# Altium project Wilamp_DCU.PrjPCB (part 2 of 2)

## Sheet pic_blk.SchDoc
size A4; Engineer: JBayalas; DocumentNumber: 11; Revision: V1.1; SheetNumber: 11; SheetTotal: 13
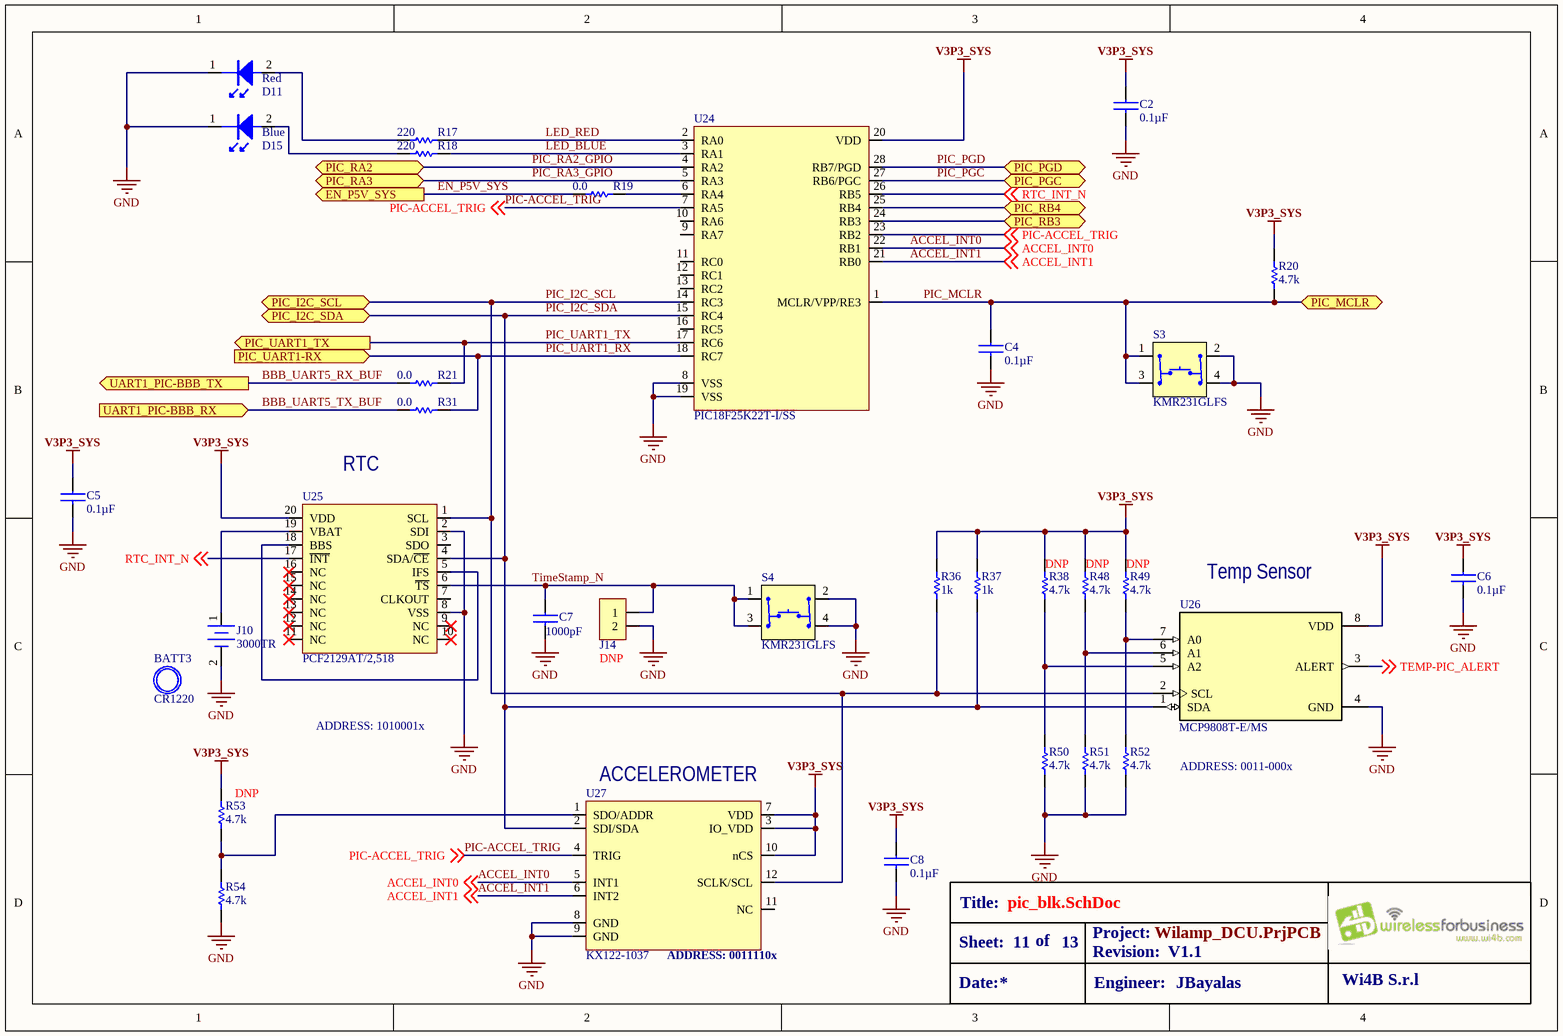
[diagram p11: pic_blk.SchDoc]

### Parts
BATT3  CR1220
C2  value 0.1µF  [C0402]  (hidden comment: *)
C4  value 0.1µF  [C0402]  (hidden comment: *)
C5  value 0.1µF  [C0402]  (hidden comment: *)
C6  value 0.1µF  [C0402]  (hidden comment: *)
C7  value 1000pF  [C0402]  (hidden comment: *)
C8  value 0.1µF  [C0402]  (hidden comment: *)
D11  value Red  [LED0402(RED)]  (hidden comment: *)
D15  value Blue  [LED0402(BLUE)]  (hidden comment: *)
J10  3000TR  [3000TR]
J14  LOAD: DNP  [2pin 5mm Pitch]  (hidden comment: *)
R17  value 220  [R0402]  (hidden comment: *)
R18  value 220  [R0402]  (hidden comment: *)
R19  value 0.0  [R0402]  (hidden comment: *)
R20  value 4.7k  [R0603]  (hidden comment: *)
R21  value 0.0  [R0402]  (hidden comment: *)
R31  value 0.0  [R0402]  (hidden comment: *)
R36  value 1k  [R0402]  (hidden comment: *)
R37  value 1k  [R0402]  (hidden comment: *)
R38  value 4.7k  LOAD: DNP  [R0402]  (hidden comment: *)
R48  value 4.7k  LOAD: DNP  [R0402]  (hidden comment: *)
R49  value 4.7k  LOAD: DNP  [R0402]  (hidden comment: *)
R50  value 4.7k  [R0402]  (hidden comment: *)
R51  value 4.7k  [R0402]  (hidden comment: *)
R52  value 4.7k  [R0402]  (hidden comment: *)
R53  value 4.7k  LOAD: DNP  [R0402]  (hidden comment: *)
R54  value 4.7k  [R0402]  (hidden comment: *)
S3  *  [KMR231G ULC LFS]  (value not drawn)
S4  *  [KMR231G ULC LFS]  (value not drawn)
U24  value PIC18F25K22T-I/SS  [SSOP-28 (PIC)]  (hidden comment: *)
U25  value PCF2129AT/2,518  [SOIC-20]  (hidden comment: *)
U26  MCP9808T-E/MS  [SOP65P490X110-8N]
U27  *  [KX122-1037]  (value not drawn)

### Ports
EN_P5V_SYS (out), PIC_I2C_SCL (bidir), PIC_I2C_SDA (bidir), PIC_MCLR (bidir), PIC_PGC (bidir), PIC_PGD (bidir), PIC_RA2 (bidir), PIC_RA3 (bidir), PIC_RB3 (bidir), PIC_RB4 (bidir), PIC_UART1-RX (in), PIC_UART1_TX (out), UART1_PIC-BBB_RX (in), UART1_PIC-BBB_TX (out)

### Nets
GND: C2.2 C4.2 C5.2 C6.2 C7.2 C8.2 D11.1 D15.1 J10.2(-) J14.2 R50.1 R51.1 R52.1 R54.1 S3.2 S3.4 S4.2 S4.4 U24.8(VSS) U24.19(VSS) U25.2(SDI) U25.8(VSS) U26.4(GND) U27.8(GND) U27.9(GND)
V3P3_SYS: C2.1 C5.1 C6.1 C8.1 R20.2 R36.2 R37.2 R38.2 R48.2 R49.2 R53.2 U24.20(VDD) U25.20(VDD) U26.8(VDD) U27.3(IO_VDD) U27.7(VDD) U27.10(nCS)
ACCEL_INT0: U24.22(RB1) U27.5(INT1) ; off-sheet ACCEL_INT0
ACCEL_INT1: U24.21(RB0) U27.6(INT2) ; off-sheet ACCEL_INT1
BBB_UART5_RX_BUF: R21.2 ; port UART1_PIC-BBB_TX
BBB_UART5_TX_BUF: R31.2 ; port UART1_PIC-BBB_RX
EN_P5V_SYS: R19.2 ; port EN_P5V_SYS
LED_BLUE: R18.2 U24.3(RA1)
LED_RED: R17.2 U24.2(RA0)
PIC-ACCEL_TRIG: U24.7(RA5) U24.23(RB2) U27.4(TRIG) ; off-sheet PIC-ACCEL_TRIG
PIC_GPIO_C: U24.25(RB4) ; port PIC_RB4
PIC_GPIO_D: U24.24(RB3) ; port PIC_RB3
PIC_I2C_SCL: R36.1 U24.14(RC3) U25.1(SCL) U26.2(SCL) U27.12(SCLK/SCL) ; port PIC_I2C_SCL
PIC_I2C_SDA: R37.1 U24.15(RC4) U25.4(SDA/~{CE}) U26.1(SDA) U27.2(SDI/SDA) ; port PIC_I2C_SDA
PIC_MCLR: C4.1 R20.1 S3.1 S3.3 U24.1(MCLR/VPP/RE3) ; port PIC_MCLR
PIC_PGC: U24.27(RB6/PGC) ; port PIC_PGC  [project net PIC_ICSP_CLK]
PIC_PGD: U24.28(RB7/PGD) ; port PIC_PGD  [project net PIC_ICSP_DAT]
PIC_RA2_GPIO: U24.4(RA2) ; port PIC_RA2  [project net PIC_GPIO_A]
PIC_RA3_GPIO: U24.5(RA3) ; port PIC_RA3  [project net PIC_GPIO_B]
PIC_UART1_RX: R31.1 U24.18(RC7) ; port PIC_UART1-RX
PIC_UART1_TX: R21.1 U24.17(RC6) ; port PIC_UART1_TX
RTC_INT_N: U24.26(RB5) U25.17(~{INT}) ; off-sheet RTC_INT_N
TEMP-PIC_ALERT: U26.3(ALERT) ; off-sheet TEMP-PIC_ALERT
TimeStamp_N: C7.1 J14.1 S4.1 S4.3 U25.6(~{TS})
NetD11_2: D11.2 R17.1
NetD15_2: D15.2 R18.1
NetJ10_1: J10.1(+) U25.19(VBAT)
NetR19_1: R19.1 U24.6(RA4)
NetR38_1: R38.1 R50.2 U26.5(A2)
NetR48_1: R48.1 R51.2 U26.6(A1)
NetR49_1: R49.1 R52.2 U26.7(A0)
NetR53_1: R53.1 R54.2 U27.1(SDO/ADDR)
NetU25_5: U25.5(IFS) U25.18(BBS)

Not connected (* = marked no-connect by the designer): U24 9(RA7) 10(RA6) 11(RC0) 12(RC1) 13(RC2) 16(RC5); U25 3(SDO) 7(CLKOUT) 9(NC)* 10(NC)* 11(NC)* 12(NC)* 13(NC)* 14(NC)* 15(NC)* 16(NC)*; U27 11(NC)

### Notes on the sheet
- RTC
- (near U26) Temp Sensor
- ADDRESS: 1010001x
- (near U27) ACCELEROMETER
- ADDRESS: 0011-000x
- (near U27) ADDRESS: 0011110x
- Title:
- Sheet:
- Date:
- of
- Project:
- Revision:
- Engineer:
- Wi4B S.r.l

### Library data of the parts
BATT3 = CR1220: Coin Cell Battery 35mAh 12.5mm; MFT: FDK; RATING: 3V, 35mAh; FUNCTION: PIC; TYPE: SMD; LOAD: *; VALUE: CR1220; MPN: CR1220
C2 C4-C6 C8 = CL05B104KO3LNNC: CAP CER 0.1UF 16V X7R 0402; MFT: Samsung Electro-Mechanics America, Inc.; RATING: ±10%, 16V; TYPE: Surface Mount, MLCC; FUNCTION: PIC; MPN: CL05B104KO3LNNC
C7 = GRM155R71H102KA01D: CAP CER 1000PF 50V X7R 0402; MFT: Murata Electronics North America; TYPE: SMD; FUNCTION: PIC; MPN: GRM155R71H102KA01D; LOAD: *; RATING: 50V
D11 = LNJ247W82RA: LED RED 0402 SMD; MFT: Panasonic Electronic Components; TYPE: Surface Mount; FUNCTION: PIC; MPN: LNJ247W82RA
D15 = VLMB1500-GS08: LED BLUE 0402 SMD; MFT: Vishay Semiconductor Opto Division; FUNCTION: PIC; MPN: VLMB1500-GS08; TYPE: SMD; RATING: *; LOAD: *
J10 = 3000TR: Coin Cell Battery Holders SM COIN CELL B/H; MFT: Keystone Electronics; FUNCTION: PIC; MPN: 3000TR; TYPE: SMD; RATING: *; LOAD: *; VALUE: 3000TR
J14 = 2PIN Signal 5mm Pitch: FUNCTION: PIC
R17 R18 = RC0402JR-07220RL: RES SMD 220 OHM 5% 1/16W 0402; MFT: Yageo; FUNCTION: PIC; MPN: RC0402JR-07220RL; RATING: *; TYPE: SMD; LOAD: *
R19 R21 R31 = CRCW04020000Z0ED: RES SMD 0.0OHM JUMPER 1/16W 0402; MFT: Vishay Dale; RATING: 63mW; FUNCTION: PIC; MPN: CRCW04020000Z0ED; TYPE: Surface Mount
R20 = ERA-3AEB472V: RES SMD 4.7K OHM 0.1% 1/10W 0603; MFT: Panasonic; FUNCTION: PIC; MPN: ERA-3AEB472V; LOAD: *; RATING: 1/10W; TYPE: SMD
R36 R37 = MCS04020C1001FE000: RES SMD 1K OHM 1% 1/10W 0402; MFT: Vishay Beyschlag; FUNCTION: PIC; MPN: MCS04020C1001FE000; TYPE: SMD; RATING: 1/10W; LOAD: *
R38 R48-R54 = RC0402JR-074K7L: RES SMD 4.7K OHM 5% 1/16W 0402; MFT: Yageo; FUNCTION: PIC; MPN: RC0402JR-074K7L; RATING: ±5%; TYPE: Surface Mount
S3 S4 = KMR231GLFS: SWITCH TACTILE SPST-NO 0.05A 32V; MFT: C&K Components; FUNCTION: PIC; VALUE: KMR231GLFS; TYPE: SMD; MPN: KMR231GLFS
U24 = PIC18F25K22T-I/SS: MCU 8BIT 32KB FLASH 28SSOP; MFT: Microchip; FUNCTION: PIC; MPN: PIC18F25K22T-I/SS; TYPE: SMD; RATING: *; LOAD: *
U25 = PCF2129AT/2,518: IC RTC /CALENDAR TCXO QTZ 20SOIC; MFT: NXP Semiconductors; FUNCTION: PIC; MPN: PCF2129AT/2,518; LOAD: *; TYPE: SMD; RATING: *
U26 = MCP9808T-E/MS: MCP9808 Series 3.6 V Memory Module Digital Temperature Sensor SMT - MSOP-8; MFT: Microchip; FUNCTION: PIC; MPN: MCP9808T-E/MS; TYPE: SMD; RATING: *; LOAD: *; VALUE: MCP9808T-E/MS
U27 = KX122-1037: ACCELEROMETER 2-8G I2C/SPI 12LGA; MFT: Kionix Inc.; FUNCTION: PIC; LOAD: *; RATING: *; TYPE: SMD; VALUE: KX122-1037; MPN: KX122-1037

## Sheet revision_history.SchDoc
size A4; Date: 10/27/2015; Engineer: JBayalas; DocumentNumber: 2; Revision: V2.0; SheetNumber: 2; SheetTotal: 14
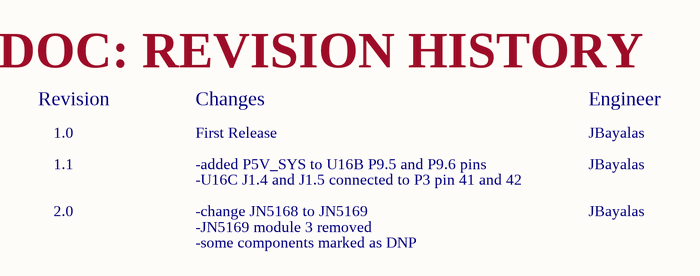
[diagram p12: revision_history.SchDoc]

### Notes on the sheet
- Revision
- Changes
- DOC: REVISION HISTORY
- Engineer
- 1.0
- 1.1
- First Release
- -added P5V_SYS to U16B P9.5 and P9.6 pins
- -U16C J1.4 and J1.5 connected to P3 pin 41 and 42
- JBayalas
- 2.0
- -change JN5168 to JN5169
- -JN5169 module 3 removed
- -some components marked as DNP
- Title:
- Sheet:
- Date:
- of
- Project:
- Revision:
- Engineer:
- Wi4B S.r.l

## Nets that join several sheets
GND: top_dsn (J15.2 J15.3), Top Design Page/JN1 (12 pins), Top Design Page/JN2 (12 pins), Top Design Page/JN3 (12 pins), crypto_blk (34 pins), bbb_blk (19 pins), PowerInFilter (6 pins), LED (10 pins), USB_Mini (5 pins), 5v_dcdc_blk (18 pins), 3v3_dcdc_blk (18 pins), headerP3_blk (7 pins), pic_blk (25 pins)
P5V0_SYS: bbb_blk (U16.P9.5 U16.P9.6), LED (Q5.1 R15.2), 5v_dcdc_blk (C40.1 L4.1 R45.1 R56.2), headerP3_blk (P3.7 P3.8)
P24_SW: top_dsn (J3.1 R2.2), headerP3_blk (P3.3 P3.4)
P24V_FILT: top_dsn (J3.2 R3.2), PowerInFilter (D6.1 R55.2), LED (5 pins), headerP3_blk (P3.1 P3.2)
V3P3_BBB: crypto_blk (29 pins), bbb_blk (11 pins), headerP3_blk (P3.14)
V3P3_SYS: Top Design Page/JN1 (9 pins), Top Design Page/JN2 (9 pins), Top Design Page/JN3 (9 pins), LED (Q2.1 R16.2), 5v_dcdc_blk (J9.1), 3v3_dcdc_blk (C33.1 L3.1 R41.2), headerP3_blk (P3.11 P3.12), pic_blk (17 pins)
B_UART0_RX: bbb_blk (U16.J1.4), headerP3_blk (P3.42)
B_UART0_TX: bbb_blk (U16.J1.5), headerP3_blk (P3.41)
BBB_UART5_RX_BUF: bbb_blk (U22.2), headerP3_blk (P3.21), pic_blk (R21.2)
BBB_UART5_TX_BUF: bbb_blk (U22.16), headerP3_blk (P3.22), pic_blk (R31.2)
CRYPTO_AUTH0: crypto_blk (R61.2 U10.2), bbb_blk (U20.17)
EN_P5V_SYS: 5v_dcdc_blk (R44.2), headerP3_blk (P3.13), pic_blk (R19.2)
I2C_CRYPTO_SCL: crypto_blk (8 pins), bbb_blk (U16.P9.19)
I2C_CRYPTO_SDA: crypto_blk (8 pins), bbb_blk (U16.P9.20)
I2C_JN_SCL: Top Design Page/JN1 (R10_JN1.1 U1_JN1.1 U3_JN1.6 U4_JN1.25), headerP3_blk (P3.31)
I2C_JN_SCL: Top Design Page/JN2 (R10_JN2.1 U1_JN2.1 U3_JN2.6 U4_JN2.25), headerP3_blk (P3.35)
I2C_JN_SCL: Top Design Page/JN3 (R10_JN3.1 U1_JN3.1 U3_JN3.6 U4_JN3.25), headerP3_blk (P3.39)
I2C_JN_SDA: Top Design Page/JN1 (R11_JN1.1 U1_JN1.3 U3_JN1.5 U4_JN1.26), headerP3_blk (P3.32)
I2C_JN_SDA: Top Design Page/JN2 (R11_JN2.1 U1_JN2.3 U3_JN2.5 U4_JN2.26), headerP3_blk (P3.36)
I2C_JN_SDA: Top Design Page/JN3 (R11_JN3.1 U1_JN3.3 U3_JN3.5 U4_JN3.26), headerP3_blk (P3.40)
LED_BBB_OK: bbb_blk (U22.9), LED (Q3.1 R9.2)
LED_FAULT: bbb_blk (U22.5), LED (Q1.1 R7.2)
LED_NET_OK: bbb_blk (U22.7), LED (Q4.1 R8.2)
NetP3_29: Top Design Page/JN1 (U4_JN1.23), headerP3_blk (P3.29)
NetP3_30: Top Design Page/JN1 (U4_JN1.24), headerP3_blk (P3.30)
NetP3_33: Top Design Page/JN2 (U4_JN2.23), headerP3_blk (P3.33)
NetP3_34: Top Design Page/JN2 (U4_JN2.24), headerP3_blk (P3.34)
NetP3_37: Top Design Page/JN3 (U4_JN3.23), headerP3_blk (P3.37)
NetP3_38: Top Design Page/JN3 (U4_JN3.24), headerP3_blk (P3.38)
P24V: top_dsn (J1.1), PowerInFilter (C46.1 C47.1 FB1.2)
PIC_GPIO_A: headerP3_blk (P3.25), pic_blk (U24.4)
PIC_GPIO_B: headerP3_blk (P3.26), pic_blk (U24.5)
PIC_GPIO_C: headerP3_blk (P3.27), pic_blk (U24.25)
PIC_GPIO_D: headerP3_blk (P3.28), pic_blk (U24.24)
PIC_I2C_SCL: headerP3_blk (P3.23), pic_blk (5 pins)
PIC_I2C_SDA: headerP3_blk (P3.24), pic_blk (5 pins)
PIC_ICSP_CLK: headerP3_blk (P3.15), pic_blk (U24.27)
PIC_ICSP_DAT: headerP3_blk (P3.16), pic_blk (U24.28)
PIC_MCLR: headerP3_blk (P3.17), pic_blk (5 pins)
PIC_UART1_RX: headerP3_blk (P3.20), pic_blk (R31.1 U24.18)
PIC_UART1_TX: headerP3_blk (P3.19), pic_blk (R21.1 U24.17)
PROG_JN1_L: Top Design Page/JN1 (D3_JN1.1 J2_JN1.5), bbb_blk (U21.9)
PROG_JN2_L: Top Design Page/JN2 (D3_JN2.1 J2_JN2.5), bbb_blk (U21.7)
PROG_JN3_L: Top Design Page/JN3 (D3_JN3.1 J2_JN3.5), bbb_blk (U21.5)
RST_BBB_SYS_L: crypto_blk (R60.1 U17.16), bbb_blk (U20.12)
RST_JN1_L: Top Design Page/JN1 (C10_JN1.1 J2_JN1.7 R12_JN1.1 U4_JN1.22), bbb_blk (U21.18)
RST_JN2_L: Top Design Page/JN2 (C10_JN2.1 J2_JN2.7 R12_JN2.1 U4_JN2.22), bbb_blk (U21.16)
RST_JN3_L: Top Design Page/JN3 (C10_JN3.1 J2_JN3.7 R12_JN3.1 U4_JN3.22), bbb_blk (U21.14)
UART_JN1_RXD0: Top Design Page/JN1 (J2_JN1.1 U4_JN1.13), bbb_blk (U20.18)
UART_JN1_TXD0: Top Design Page/JN1 (J2_JN1.3 U4_JN1.12), bbb_blk (U20.11)
UART_JN2_RXD0: Top Design Page/JN2 (J2_JN2.1 U4_JN2.13), bbb_blk (U20.16)
UART_JN2_TXD0: Top Design Page/JN2 (J2_JN2.3 U4_JN2.12), bbb_blk (U20.13)
UART_JN3_RXD0: Top Design Page/JN3 (J2_JN3.1 U4_JN3.13), bbb_blk (U20.14)
UART_JN3_TXD0: Top Design Page/JN3 (J2_JN3.3 U4_JN3.12), bbb_blk (U20.15)
USB_D_N: USB_Mini (P1.2), headerP3_blk (P3.44)
USB_D_P: USB_Mini (P1.3), headerP3_blk (P3.43)
V24P0: top_dsn (R2.1 R3.1), 5v_dcdc_blk (6 pins), 3v3_dcdc_blk (7 pins)

## Assembly variants
Variant of WiLamp(Proto): not fitted B1 C7 C10 C11 C12 C13 C19 C20 D1 D2 D3 D4 D5 D10 D11 FB1 P7 P8 P104 P106 Q1 Q2 R19 R21 R22 R23 R24 R25 R26 R27 R28 R29 R38 R39 R40 R41 R42 R521 U3 U4 U5 U6 X1 X2